# Altium schematic sheet Power.SchDoc
size A
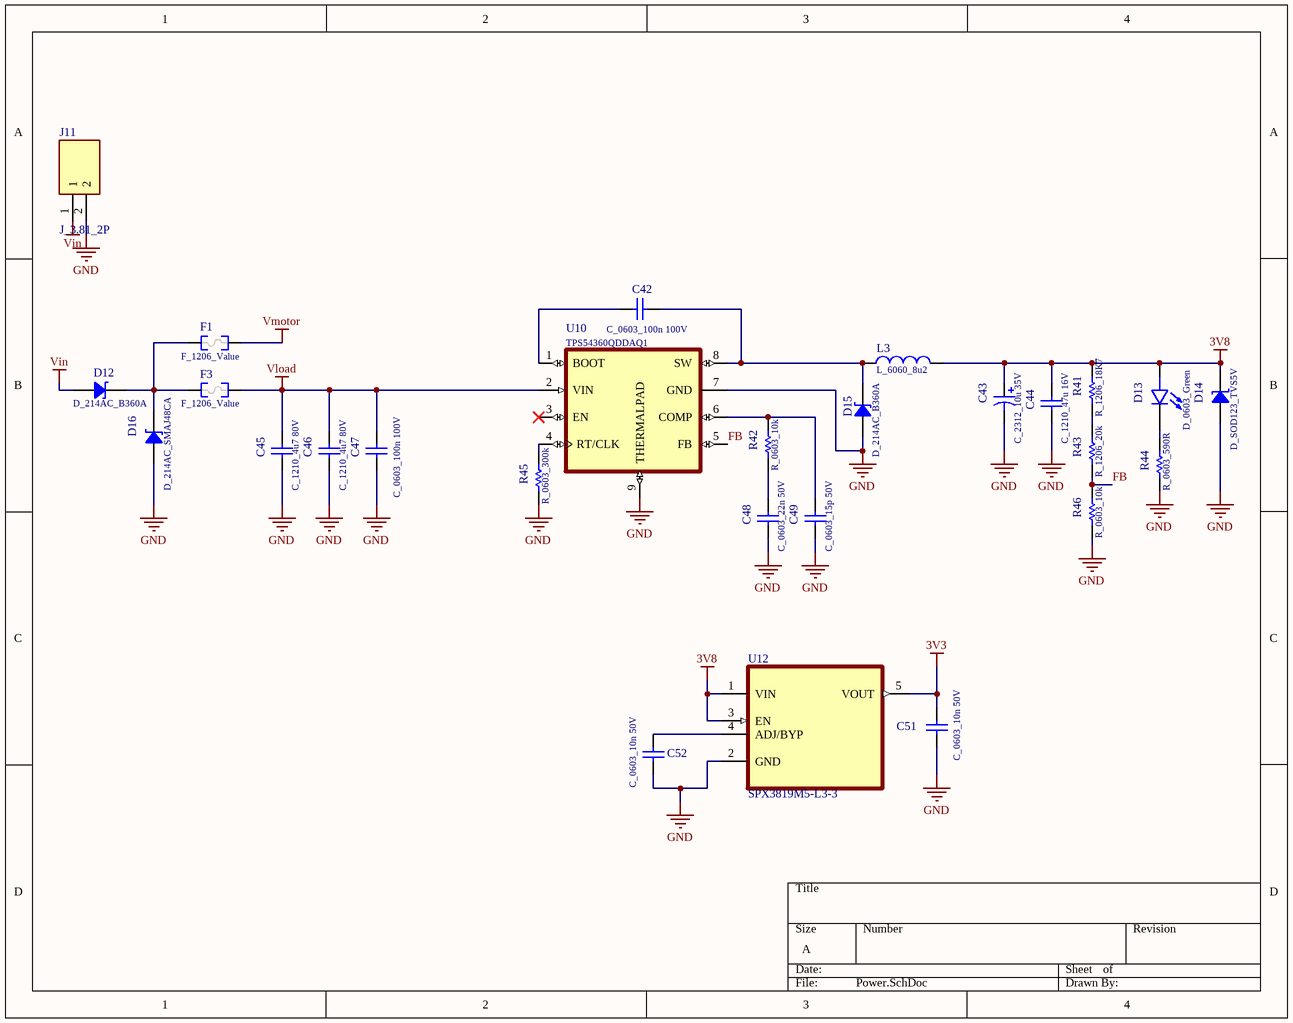
[diagram p0: Power.SchDoc]

## Parts
C42  C_0603_100n 100V  [CAP 0603]
C43  C_2312_10u 35V  [CAP 2312 TAN]
C44  C_1210_47u 16V  [CAP 1210]
C45  C_1210_4u7 80V  [CAP 1210]
C46  C_1210_4u7 80V  [CAP 1210]
C47  C_0603_100n 100V  [CAP 0603]
C48  C_0603_22n 50V  [CAP 0603]
C49  C_0603_15p 50V  [CAP 0603]
C51  C_0603_10n 50V  [CAP 0603]
C52  C_0603_10n 50V  [CAP 0603]
D12  D_214AC_B360A  [DO214AC SMA]
D13  D_0603_Green  [Led 0603]
D14  D_SOD123_TVS5V  [SOD-123]
D15  D_214AC_B360A  [DO214AC SMA]
D16  D_214AC_SMAJ48CA  [DO214AC SMA]
F1  F_1206_Value  [FUSE 1206_3216 0.6MM]
F3  F_1206_Value  [FUSE 1206_3216 0.6MM]
J11  J_3.81_2P  [2 Pin PCB TB 3.81]
L3  L_6060_8u2  [Inductor 6060]
R41  R_1206_18K7  [RES 1206]
R42  R_0603_10k  [RES 0603]
R43  R_1206_20k  [RES 1206]
R44  R_0603_590R  [RES 0603]
R45  R_0603_300k  [RES 0603]
R46  R_0603_10k  [RES 1206]
U10  TPS54360QDDAQ1  [SOIC8]
U12  SPX3819M5-L3-3  [SOT23-5]

## Nets
3V3: C51.2 U12.5(VOUT)
3V8: C43.1 C44.1 D13.1(A) D14.2 L3.2 R41.2 U12.1(VIN) U12.3(EN)
GND: C43.2 C44.2 C45.2 C46.2 C47.2 C48.2 C49.2 C51.1 C52.1 D14.1 D15.1 D16.1 J11.2 R44.1 R45.1 R46.1 U10.7(GND) U10.9(THERMALPAD) U12.2(GND)
Vin: D12.1 J11.1
Vload: C45.1 C46.1 C47.1 F3.2 U10.2(VIN)
Vmotor: F1.2
FB: R43.1 R46.2 U10.5(FB)
NetC42_1: C42.1 D15.2 L3.1 U10.8(SW)
NetC42_2: C42.2 U10.1(BOOT)
NetC48_1: C48.1 R42.1
NetC49_1: C49.1 R42.2 U10.6(COMP)
NetC52_2: C52.2 U12.4(ADJ/BYP)
NetD12_2: D12.2 D16.2 F1.1 F3.1
NetD13_2: D13.2(C) R44.2
NetR41_1: R41.1 R43.2
NetR45_2: R45.2 U10.4(RT/CLK)

Not connected (* = marked no-connect by the designer): U10 3(EN)*

## Library data of the parts
C42 C44-C49 C51 C52 = Cap: Capacitor; Published: 8-Jun-2000; LatestRevisionDate: 17-Jul-2002; LatestRevisionNote: Re-released for DXP Platform.; Publisher: Altium Limited
C43 = Cap Tantalium: Capacitor Tantalium; Published: 8-Jun-2000; LatestRevisionDate: 17-Jul-2002; LatestRevisionNote: Re-released for DXP Platform.; Publisher: Altium Limited
D12 D15 D16 = Diode Zener: Zener Diode
D13 = Led: MP: SML-D12FWT86; MF: Rohm; Price: None; Availability: In Stock; Package: 0603 Rohm; SnapEDA_Link: https://www.snapeda.com/parts/SML-D12FWT86/Rohm/view-part/?ref=snap; Check_prices: https://www.snapeda.com/parts/SML-D12FWT86/Rohm/view-part/?ref=eda; Value: *; Purchase-URL: https://pricing.snapeda.com/search/part/SML-D12FWT86/?ref=eda
D14 = DIODE TVS UNI: Rectifier Diode
F1 F3 = Fuse
J11 = 2 Pin PCB Terminal Block: MF: CUI Devices; MP: TBP02R1-381-02BE; CUI_purchase_URL: https://www.cuidevices.com/product/interconnect/connectors/terminal-blocks/tbp02r1-381-series?utm_source=snapeda.com&utm_medium=referral&utm_campaign=snapedaBOM; Purchase-URL: https://pricing.snapeda.com/search/part/TBP02R1-381-02BE/?ref=eda; Price: None; SnapEDA_Link: https://www.snapeda.com/parts/TBP02R1-381-02BE/CUI+Devices/view-part/?ref=snap; Check_prices: https://www.snapeda.com/parts/TBP02R1-381-02BE/CUI+Devices/view-part/?ref=eda; Package: None; Availability: In Stock; Value: *
L3 = Inductor: PCB_Layout: Complies with manufacturer's recommendation.; Published: 26-Sep-2008; DatasheetVersion: Mar-2008; PackageVersion: Mar-2008; PackageReference: B82462G4; Publisher: Altium Limited; PackageDescription: SM Power Inductor; 2 Leads; Body 6.3 x 6.3 x 3.0 mm (LxWxH); ComponentLink1Description: Manufacturer Link; ComponentLink1URL: http://www.epcos.com/; ComponentLink2Description: Datasheet; ComponentLink2URL: http://www.epcos.com/inf/30/db/ind_2008/b82462g4.pdf
R41-R46 = Res: Resistor; Published: 8-Jun-2000; LatestRevisionDate: 17-Jul-2002; LatestRevisionNote: Re-released for DXP Platform.; Publisher: Altium Limited
U12 = SPX3819M5-L: Linear Voltage Regulator IC 1 Output 500mA SOT-23-5; MP: SPX3819M5-L/TR; MF: MaxLinear, Inc.; Package: SOT-23-5 Exar; SnapEDA_Link: https://www.snapeda.com/parts/SPX3819M5-L/TR/MaxLinear,%20Inc./view-part/35772/?ref=snap; Digi-Key_Purchase_URL: https://www.digikey.com/product-detail/en/maxlinear-inc/SPX3819M5-L-TR/1016-1871-1-ND/3586588?utm_source=snapeda&utm_medium=aggregator&utm_campaign=symbol; Value: *; Digi-Key_Part_Number: 1016-1871-1-ND
U10 = TPS54360QDDAQ1: Package: None; Price: None; Value: *; MP: TPS54360QDDAQ1; Availability: Unavailable